# Altium schematic sheet micro.SchDoc
size A4; SheetNumber: 1; SheetTotal: 3
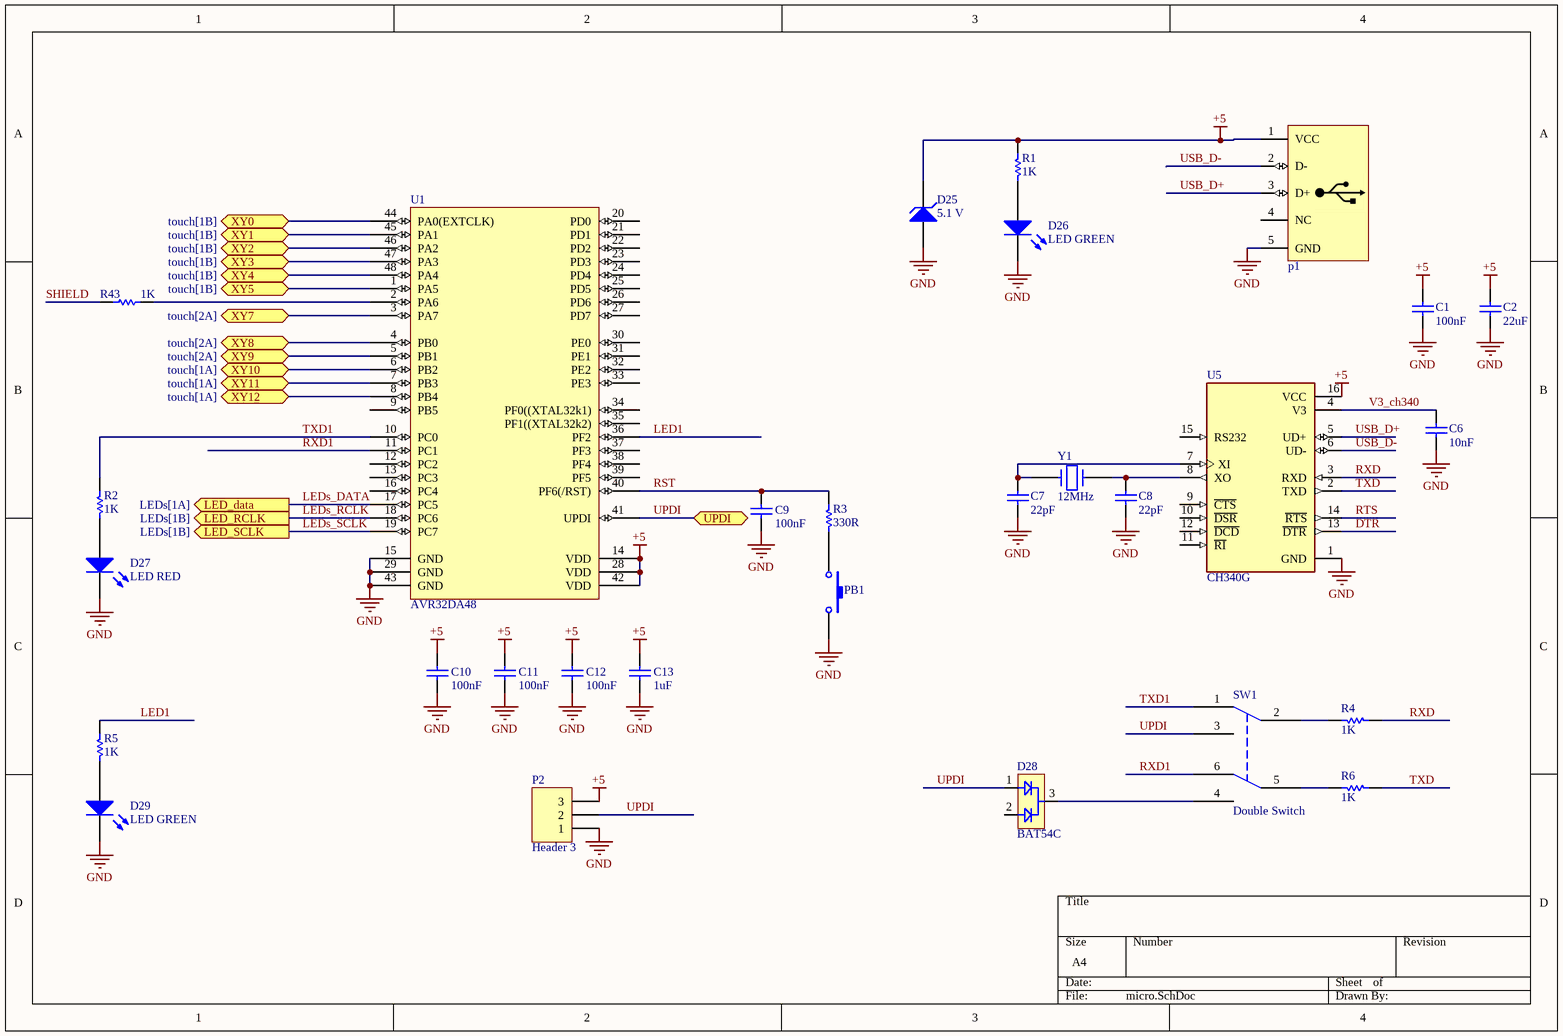
[diagram p0: micro.SchDoc]

## Parts
C1  100nF  [SMD_CAP_0805]
C2  22uF  [SMD_CAP_0805]
C6  10nF  [SMD_CAP_0805]
C7  22pF  [SMD_CAP_0805]
C8  22pF  [SMD_CAP_0805]
C9  value 100nF  [CAP0805]  (hidden comment: cap 100nF)
C10  value 100nF  [CAP0805]  (hidden comment: cap 100nF)
C11  value 100nF  [CAP0805]  (hidden comment: cap 100nF)
C12  value 100nF  [CAP0805]  (hidden comment: cap 100nF)
C13  value 1uF  [CAP0805]  (hidden comment: cap 1uF)
D25  Voltage: 5.1 V  [Diode 1n4148 SMD]  (hidden comment: Diode Zener)
D26  LED GREEN  [LED_0805 G]
D27  LED RED  [LED_0805 G]
D28  BAT54C  [SOT-23]
D29  LED GREEN  [LED_0805 G]
p1  USB Connector  [USB_AB_BM_SHS]  (value not drawn)
P2  Header 3  [HDR1X3]
PB1  Push-Button-tall  [tack-sw-3x5x6]  (value not drawn)
R1  value 1K  [RES0805]  (hidden comment: Res 1K)
R2  value 1K  [RES0805]  (hidden comment: Res 1K)
R3  value 330R  [RES0805]  (hidden comment: Res 330R)
R4  value 1K  [RES0805]  (hidden comment: Res 1K)
R5  value 1K  [RES0805]  (hidden comment: Res 1K)
R6  value 1K  [RES0805]  (hidden comment: Res 1K)
R43  1K  [RES 0805 (2012X06L)]
SW1  Double Switch  [switch_2way_DPDT_right]
U1  AVR32DA48  [TQPF48]
U5  CH340G  [SOIC16_N]
Y1  12MHz  [XTAL_SMD]

## Ports
LED_data (out, see LEDs[1A]), LED_RCLK (out, see LEDs[1B]), LED_SCLK (out, see LEDs[1B]), UPDI (bidir), XY0 (bidir, see touch[1B]), XY1 (bidir, see touch[1B]), XY2 (bidir, see touch[1B]), XY3 (bidir, see touch[1B]), XY4 (bidir, see touch[1B]), XY5 (bidir, see touch[1B]), XY7 (bidir, see touch[2A]), XY8 (bidir, see touch[2A]), XY9 (bidir, see touch[2A]), XY10 (bidir, see touch[1A]), XY11 (bidir, see touch[1A]), XY12 (bidir, see touch[1A])

## Nets
+5: C1.2 C2.2 C10.2 C11.2 C12.2 C13.2 D25.2(K) p1.1(VCC) P2.3 R1.1 U1.14(VDD) U1.28(VDD) U1.42(VDD) U5.16(VCC)
GND: C1.1 C2.1 C6.1 C7.1 C8.1 C9.1 C10.1 C11.1 C12.1 C13.1 D25.1(A) D26.2(K) D27.2(K) D29.2(K) p1.5(GND) P2.1 PB1.1 U1.15(GND) U1.29(GND) U1.43(GND) U5.1(GND)
DTR: U5.13(~{DTR})
LED1: R5.1 U1.36(PF2)
LEDs_DATA: U1.17(PC5) ; port LED_data
LEDs_RCLK: U1.18(PC6) ; port LED_RCLK
LEDs_SCLK: U1.19(PC7) ; port LED_SCLK
RST: C9.2 R3.1 U1.40(PF6(/RST))
RTS: U5.14(~{RTS})
RXD: R4.2 U5.3(RXD)
RXD1: SW1.6 U1.11(PC1)
SHIELD: R43.2
TXD: R6.2 U5.2(TXD)
TXD1: R2.1 SW1.1 U1.10(PC0)
UPDI: D28.1 P2.2 SW1.3 U1.41(UPDI) ; port UPDI
USB_D+: p1.3(D+) U5.5(UD+)
USB_D-: p1.2(D-) U5.6(UD-)
V3_ch340: C6.2 U5.4(V3)
XY0: U1.44(PA0(EXTCLK)) ; port XY0
XY1: U1.45(PA1) ; port XY1
XY2: U1.46(PA2) ; port XY2
XY3: U1.47(PA3) ; port XY3
XY4: U1.48(PA4) ; port XY4
XY5: U1.1(PA5) ; port XY5
XY7: U1.3(PA7) ; port XY7
XY8: U1.4(PB0) ; port XY8
XY9: U1.5(PB1) ; port XY9
XY10: U1.6(PB2) ; port XY10
XY11: U1.7(PB3) ; port XY11
XY12: U1.8(PB4) ; port XY12
NetC7_2: C7.2 U5.7(XI) Y1.1
NetC8_2: C8.2 U5.8(XO) Y1.2
NetD26_1: D26.1(A) R1.2
NetD27_1: D27.1(A) R2.2
NetD28_3: D28.3 SW1.4
NetD29_1: D29.1(A) R5.2
NetPB1_2: PB1.2 R3.2
NetR4_1: R4.1 SW1.2
NetR6_1: R6.1 SW1.5
NetR43_1: R43.1 U1.2(PA6)

Not connected (* = marked no-connect by the designer): D28 2; p1 4(NC); U1 9(PB5) 12(PC2) 13(PC3) 16(PC4) 20(PD0) 21(PD1) 22(PD2) 23(PD3) 24(PD4) 25(PD5) 26(PD6) 27(PD7) 30(PE0) 31(PE1) 32(PE2) 33(PE3) 34(PF0((XTAL32k1)) 35(PF1((XTAL32k2)) 37(PF3) 38(PF4) 39(PF5); U5 9(~{CTS}) 10(~{DSR}) 11(~{RI}) 12(~{DCD}) 15(RS232)

## Library data of the parts
C1 C2 C6-C8 = Cap: CAP SMD 0805; Published: 8-Jun-2000; LatestRevisionDate: 17-Jul-2002; LatestRevisionNote: Re-released for DXP Platform.; PackageReference: RAD-0.3; Publisher: Altium Limited; PackageDescription: Radial Cap, Thru-Hole; 2 Leads; 0.3 in Pin Spacing
  C1: Value: 100nF
  C2: Value: 22uF
  C6: Value: 10nF
  C7 C8: Value: 22pF
C9-C13 = Cap ceramic: CAP seramic
D25 = Diode Zener: Zener Diode; Designer: Saeid Jorablo; Company: E.P.I.L; Design Date: 2011/11/02
D26 D29 = LED0: LED SMD 0805 GREEN; Published: 8-Jun-2000; LatestRevisionDate: 08-Jul-2005; LatestRevisionNote: Mech Layer 1 removed.; PackageReference: LED-0; Publisher: Altium Limited; PackageDescription: LED; 2 Leads
D27 = LED0: LED SMD 0805 RED; Published: 8-Jun-2000; LatestRevisionDate: 08-Jul-2005; LatestRevisionNote: Mech Layer 1 removed.; PackageReference: LED-0; Publisher: Altium Limited; PackageDescription: LED; 2 Leads
p1 = USB MICRO: USB Connector MICRO-B Type; Designer: ABBAS BASEREH; Max Current: 1600mA; Mounting Technology: Surface Mount\Through-Hole; Category: Connector; Pin Count: 5-7; Publisher: ABBAS BASEREH; Status: Unreleased; ComponentLink1Description: Datasheet; ComponentLink2Description: Reference; Update: 1395-11-17
P2 = Header 3: Header, 3-Pin; LatestRevisionDate: 17-Jul-2002; LatestRevisionNote: Re-released for DXP Platform.; Publisher: Altium Limited
R1-R6 R43 = Res1: Resistor; Published: 8-Jun-2000; LatestRevisionDate: 17-Jul-2002; LatestRevisionNote: Re-released for DXP Platform.; PackageReference: AXIAL-0.3; Publisher: Altium Limited; PackageDescription: Axial Device, Thru-Hole; 2 Leads; 0.3 in Pin Spacing
  R43: Value: 1K
SW1 = Switch - DPDT: DPDT Switch
U5 = CH340G: USB Interface Integrated Circuit; MF: WCH; Price: None; SnapEDA_Link: https://www.snapeda.com/parts/Ch340G/WCH/view-part/?ref=snap; MP: Ch340G; Value: *; Availability: Not in stock; Package: None; Check_prices: https://www.snapeda.com/parts/Ch340G/WCH/view-part/?ref=eda
Y1 = CRYSTAL